# EAGLE schematic timer (EAGLE 6.5.0)
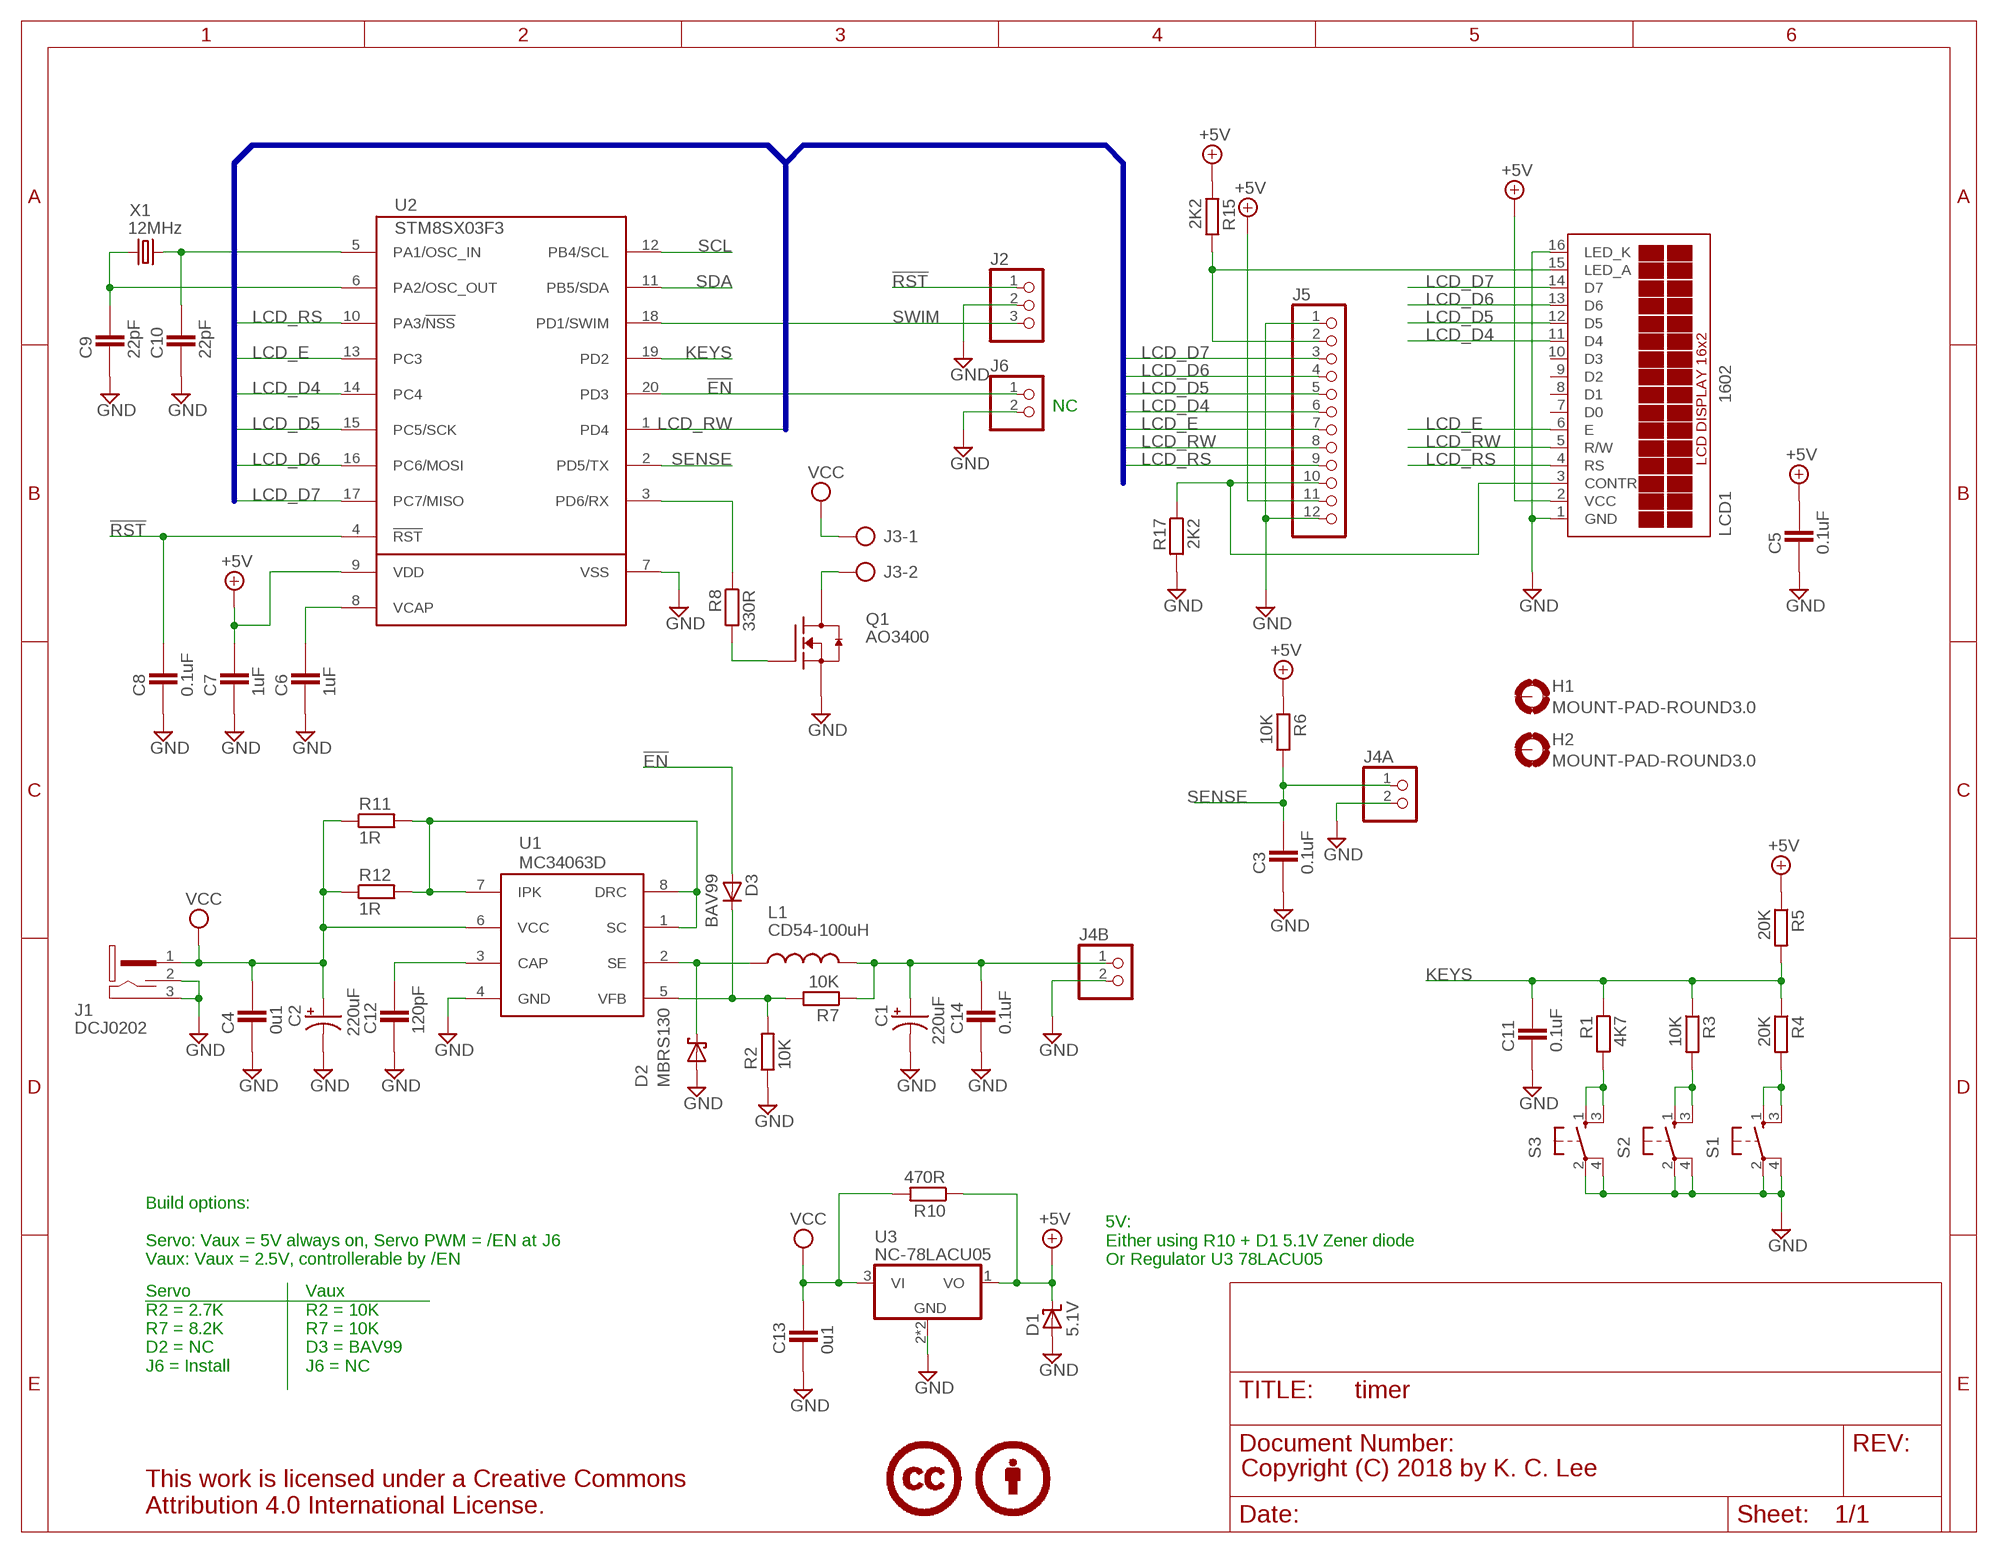
[diagram p0: schematic, sheet 1]

## Parts
C1  220uF  CAP_POLG  [PANASONIC_G]
C2  220uF  CAP_POLG  [PANASONIC_G]
C3  0.1uF  CAPACITOR_0603  [CAPC1608X92N]
C4  0u1  CAPACITOR_0805  [CAPC2012X145AN]
C5  0.1uF  CAPACITOR_0603  [CAPC1608X92N]
C6  1uF  CAPACITOR_0603  [CAPC1608X92N]
C7  1uF  CAPACITOR_0603  [CAPC1608X92N]
C8  0.1uF  CAPACITOR_0603  [CAPC1608X92N]
C9  22pF  CAPACITOR_0603  [CAPC1608X92N]
C10  22pF  CAPACITOR_0603  [CAPC1608X92N]
C11  0.1uF  CAPACITOR_0603  [CAPC1608X92N]
C12  120pF  CAPACITOR_1206  [CAPC3215X168N]
C13  0u1  CAPACITOR_0805  [CAPC2012X145AN]
C14  0.1uF  CAPACITOR_0805  [CAPC2012X145AN]
D1  5.1V  ZENER_SOD-323  [SOD2514X100N]
D2  MBRS130  SCHOTTKY_SMB  [DIOM5436X265N]
D3  BAV99  DIODE_SOT-23  [SOT95P280X135-3N]
H1  MOUNT-PAD-ROUND3.0  [3,0-PAD]
H2  MOUNT-PAD-ROUND3.0  [3,0-PAD]
J1  DCJ0202  [DCJ0202-SLOTTED]
J2  PINHD-1X3_2.54  [1X03]
J3  AK500/2  [AK500/2]
J4A  PINHD-1X2_2.54  [1X02]
J4B  PINHD-1X2_2.54  [1X02]
J5  PINHD-1X12_2.54  [1X12]
J6  PINHD-1X2_2.54  [1X02]
L1  CD54-100uH  CD54  [CD54]
LCD1  1602  TUXGR_16X2_R2NOMOUNT  [TUXGR_16X2_R2_NM]
LICENSE1  CC-BY100%  [CC-BY-100]
Q1  AO3400  MOSFET-NCH_SOT-23  [SOT95P280X135-3N]
R1  4K7  RESISTOR_0603  [RESC1608X55N]
R2  10K  RESISTOR_0603  [RESC1608X55N]
R3  10K  RESISTOR_0603  [RESC1608X55N]
R4  20K  RESISTOR_0603  [RESC1608X55N]
R5  20K  RESISTOR_0603  [RESC1608X55N]
R6  10K  RESISTOR_0603  [RESC1608X55N]
R7  10K  RESISTOR_0603  [RESC1608X55N]
R8  330R  RESISTOR_0603  [RESC1608X55N]
R10  470R  RESISTOR_0603  [RESC1608X55N]
R11  1R  RESISTOR_0805  [RESC2012X70N]
R12  1R  RESISTOR_0805  [RESC2012X70N]
R15  2K2  RESISTOR_0603  [RESC1608X55N]
R17  2K2  RESISTOR_0603  [RESC1608X55N]
S1  MOM_SWTH  [MOM_SW]
S2  MOM_SWTH  [MOM_SW]
S3  MOM_SWTH  [MOM_SW]
U1  MC34063D  [SO-8]
U2  STM8SX03F3  [TSSOP20]
U3  NC-78LACU05  78LACU  [SOT89]
X1  12MHz  CRYSTALSM49  [SM49]

## Nets
!EN: D3.1(A) J6.1 U2.20(PD3)
!RST: C8.2 J2.1 U2.4(!RST)
+5V: C5.2 C7.2 D1.K J5.11 LCD1.2(VCC) R5.1 R6.1 R10.1 R15.1 U2.9(VDD) U3.1(VO)
+VOUT: C1.+ C14.2 J4B.1 L1.2 R7.1
GND: C1.- C2.- C3.1 C4.1 C5.1 C6.1 C7.1 C8.1 C9.1 C10.1 C11.1 C12.1 C13.1 C14.1 D1.A D2.A J1.2 J1.3 J2.2 J4A.2 J4B.2 J5.1 J5.12 J6.2 LCD1.1(GND) LCD1.16(LED_K) Q1.2(S) R2.1 R17.2 S1.2 S1.4 S2.2 S2.4 S3.2 S3.4 U1.4(GND) U2.7(VSS) U3.2(GND) U3.4(GND)
KEYS: C11.2 R1.1 R3.1 R4.1 R5.2 U2.19(PD2)
LCD_A: J5.2 LCD1.15(LED_A) R15.2
LCD_D4: J5.6 LCD1.11(D4) U2.14(PC4)
LCD_D5: J5.5 LCD1.12(D5) U2.15(PC5/SCK)
LCD_D6: J5.4 LCD1.13(D6) U2.16(PC6/MOSI)
LCD_D7: J5.3 LCD1.14(D7) U2.17(PC7/MISO)
LCD_E: J5.7 LCD1.6(E) U2.13(PC3)
LCD_RS: J5.9 LCD1.4(RS) U2.10(PA3/!NSS)
LCD_RW: J5.8 LCD1.5(R/W) U2.1(PD4)
N$1: J3.2 Q1.3(D)
N$2: C6.2 U2.8(VCAP)
N$3: D3.3(K) R2.2 R7.2 U1.5(VFB)
N$4: C10.2 U2.5(PA1/OSC_IN) X1.2
N$5: C9.2 U2.6(PA2/OSC_OUT) X1.1
N$6: R11.2 R12.2 U1.1(SC) U1.7(IPK) U1.8(DRC)
N$7: D2.K L1.1 U1.2(SE)
N$8: C12.2 U1.3(CAP)
N$9: R4.2 S1.1 S1.3
N$16: Q1.1(G) R8.2
N$17: R8.1 U2.3(PD6/RX)
N$18: R3.2 S2.1 S2.3
N$19: R1.2 S3.1 S3.3
N$27: J5.10 LCD1.3(CONTR) R17.1
SCL: U2.12(PB4/SCL)
SDA: U2.11(PB5/SDA)
SENSE: C3.2 J4A.1 R6.2 U2.2(PD5/TX)
SWIM: J2.3 U2.18(PD1/SWIM)
VCC: C2.+ C4.2 C13.2 J1.1 J3.1 R10.2 R11.1 R12.1 U1.6(VCC) U3.3(VI)
Unconnected: H1.B3,0(MOUNT) H2.B3,0(MOUNT) LCD1.7(D0) LCD1.8(D1) LCD1.9(D2) LCD1.10(D3)

## Buses
B$1

## Notes on the sheet
- NC
- Build options:
  
  Servo: Vaux = 5V always on, Servo PWM = /EN at J6
  Vaux: Vaux = 2.5V, controllerable by /EN
- 5V: 
  Either using R10 + D1 5.1V Zener diode
  Or Regulator U3 78LACU05
- Servo
  R2 = 2.7K
  R7 = 8.2K
  D2 = NC
  J6 = Install
- Vaux
  R2 = 10K
  R7 = 10K
  D3 = BAV99
  J6 = NC
- Copyright (C) 2018 by K. C. Lee

## Library data of the parts
C1 C2 = Misc Passives:CAP_POL: Capacitor Polarized These are standard SMD and PTH capacitors. Normally 10uF, 47uF, and 100uF in electrolytic and tantalum varieties. Always verify the external diameter of the through hole cap, it varies with capacity, voltage, and manufacturer. The EIA devices should be standard.
C3-C14 = ipc-7351-capacitor:CAPACITOR_
D1 = ipc-7351-diode:ZENER_
D2 = ipc-7351-diode:SCHOTTKY_
D3 = ipc-7351-diode:DIODE_
H1 H2 = holes:MOUNT-PAD-ROUND: MOUNTING PAD, round
J1 = Misc Conn:DCJ0202: DC POWER JACK Source: DCJ0202.pdf Pin = CUI Inc. PJ-102A with formed pins
J2 = pinhead-1:PINHD-1X3: PIN HEADER
J3 = con-ptr500:AK500/2: CONNECTOR
J4A J4B J6 = pinhead-1:PINHD-1X2: PIN HEADER
J5 = pinhead-1:PINHD-1X12: PIN HEADER
L1 = Misc Inductors:CD
LCD1 = Misc opto:TUXGR_16X2_R2: Tuxgraphics LCD display 16x2 characters reflective, without background light Source: tuxgr_12x2_r2.pdf; OC_FARNELL: unknown; OC_NEWARK: unknown
LICENSE1 = Misc logo:CC-BY
Q1 = ipc-7351-transistor:MOSFET-NCH_
R1-R8 R10-R12 R15 R17 = ipc-7351-resistor:RESISTOR_
S1-S3 = Misc Passives:MOM_SW: Tact Switch
U1 = Misc Power:MC34063
U2 = Misc Processor:STM8SX03F
U3 = Misc Power:78L*: Positive VOLTAGE REGULATOR Source: http://cache.national.com/ds/LM/LM78L05.pdf http://www.fairchildsemi.com/ds/LM/LM7805.pdf
X1 = crystal:CRYSTAL: CRYSTAL; OC_FARNELL: unknown; OC_NEWARK: unknown